# EAGLE design decoder (EAGLE 6.2)
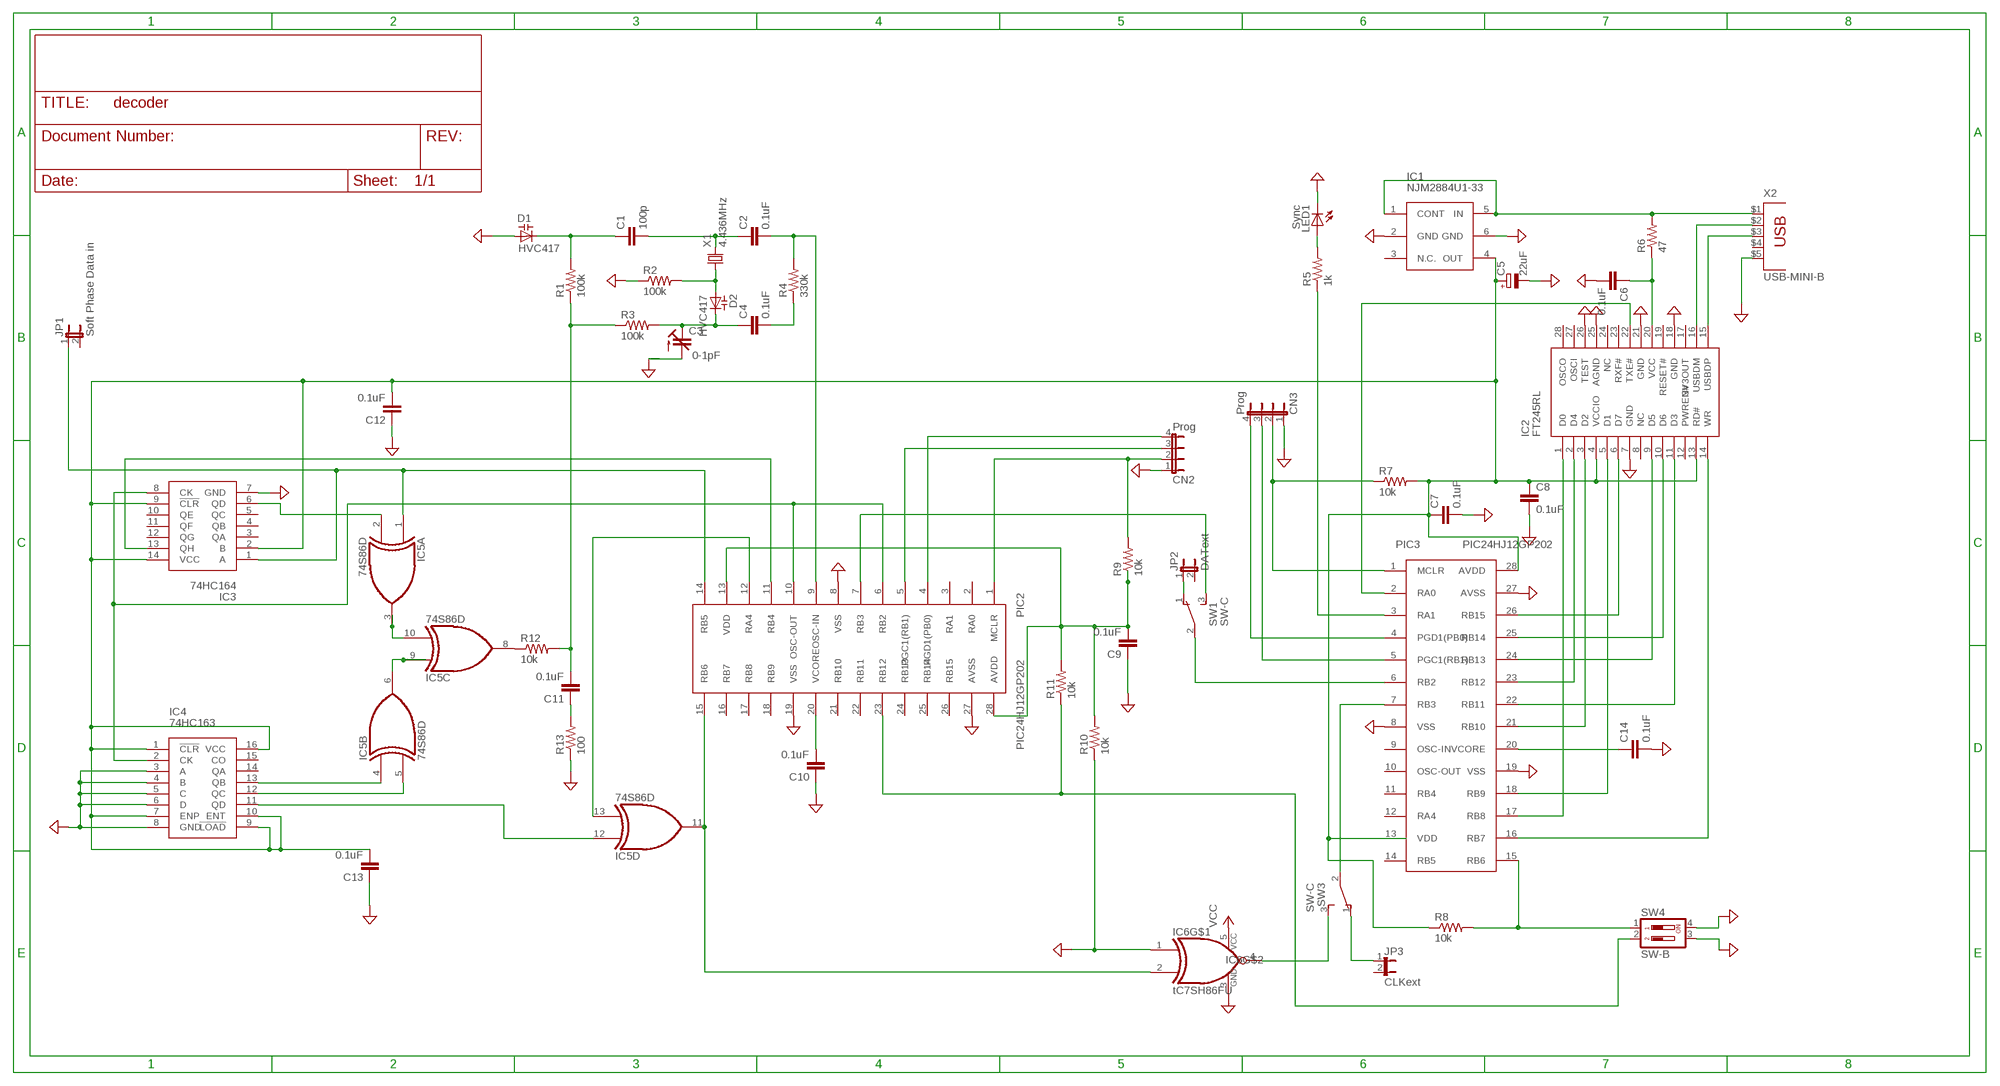
[diagram p0: schematic, sheet 1]

## Parts
C1  100p  C-EU025-025X050  [C025-025X050]
C2  0.1uF  C-EU050-025X075  [C050-025X075]
C3  0-1pF  C-TRIMMTZ03  [CTRIMTZ03]
C4  0.1uF  C-EU050-025X075  [C050-025X075]
C5  22uF  CPOL-EUE3.5-8  [E3,5-8]
C6  0.1uF  C-EU050-025X075  [C050-025X075]
C7  0.1uF  C-EU050-025X075  [C050-025X075]
C8  0.1uF  C-EU050-025X075  [C050-025X075]
C9  0.1uF  C-EU050-025X075  [C050-025X075]
C10  0.1uF  C-EU050-025X075  [C050-025X075]
C11  0.1uF  C-EU050-025X075  [C050-025X075]
C12  0.1uF  C-EU050-025X075  [C050-025X075]
C13  0.1uF  C-EU050-025X075  [C050-025X075]
C14  0.1uF  C-EU050-025X075  [C050-025X075]
CN2  Prog  JP4E  [JP4]
CN3  Prog  JP4E  [JP4]
D1  HVC417  BB112  [SOT54H]
D2  HVC417  BB112  [SOT54H]
IC1  NJM2884U1-33  [NJM2884U1-33]
IC2  FT245RL  [FT245RL]
IC3  74HC164  [74HC164]
IC4  74HC163  [74HC163]
IC5  74S86D  [SO14]
IC6  tC7SH86FU  TC7SH86FU  [TC7SH86FU]
JP1  Soft Phase Data in  JP1E  [JP1]
JP2  DAText  JP1E  [JP1]
JP3  CLKext  JP1E  [JP1]
LED1  Sync  LED5MM  [LED5MM]
PIC2  PIC24HJ12GP202  [PIC24HJ12GP202]
PIC3  PIC24HJ12GP202  [PIC24HJ12GP202]
R1  100k  R-US_0207/7  [0207/7]
R2  100k  R-US_0207/7  [0207/7]
R3  100k  R-US_0207/7  [0207/7]
R4  330k  R-US_0207/7  [0207/7]
R5  1k  R-US_0207/7  [0207/7]
R6  47  R-US_0207/7  [0207/7]
R7  10k  R-US_0207/7  [0207/7]
R8  10k  R-US_0207/7  [0207/7]
R9  10k  R-US_0207/7  [0207/7]
R10  10k  R-US_0207/7  [0207/7]
R11  10k  R-US_0207/7  [0207/7]
R12  10k  R-US_0207/7  [0207/7]
R13  100  R-US_0207/7  [0207/7]
SW1  SW-C  TL36PO  [TL3XPO]
SW3  SW-C  TL36PO  [TL3XPO]
SW4  SW-B  DIP02YL  [DIP02YL]
X1  4.436MHz  CRYSTALHC49S  [HC49/S]
X2  USB-MINI-B  [USB-MINI-B]

## Nets
GND: C3.2(A) C5.- C6.2 C7.2 C8.2 C9.1 C10.1 C12.1 C13.1 C14.2 CN2.1 CN3.1 D1.A IC1.2(GND) IC1.6(GND) IC2.7(GND) IC2.18(GND) IC2.21(GND) IC2.25(AGND) IC2.26(TEST) IC3.7(GND) IC4.3(A) IC4.4(B) IC4.5(C) IC4.6(D) IC4.8(GND) IC6.1(I0) IC6.3(GND) LED1.K(C) PIC2.8(VSS) PIC2.19(VSS) PIC2.27(AVSS) PIC3.8(VSS) PIC3.19(VSS) PIC3.27(AVSS) R2.1 R10.1 R13.1 SW4.3 SW4.4 X2.$5
N$1: IC1.1(CONT) IC1.5(IN) R6.2 X2.$1
N$2: C4.2 R4.1
N$3: C1.2 C2.1 X1.2
N$4: C2.2 PIC2.9(OSC-IN) R4.2
N$5: CN2.2 PIC2.1(MCLR) R9.2
N$6: C3.1(E) C4.1 D2.C R3.2
N$7: C1.1 D1.C R1.2
N$8: IC5.8(C:O) R12.1
N$9: C10.2 PIC2.20(VCORE)
N$10: PIC2.23(RB12) R11.1 SW4.2
N$11: PIC3.15(RB6) R8.2 SW4.1
N$12: C11.1 R13.2
N$13: PIC2.7(RB3) SW1.3(S)
N$14: PIC3.6(RB2) SW1.2(P)
N$15: IC5.11(D:O) IC6.2(I1) PIC2.15(RB6)
N$16: PIC3.3(RA1) R5.1
N$17: PIC3.7(RB3) SW3.2(P)
N$18: C9.2 PIC2.13(VDD) PIC2.28(AVDD) R9.1 R10.2 R11.2
N$19: IC2.22(TXE#) PIC3.2(RA0)
N$20: C11.2 R1.1 R3.1 R12.2
N$21: IC5.6(B:O) IC5.9(C:I0)
N$22: IC5.3(A:O) IC5.10(C:I1)
N$23: IC3.1(A) IC5.1(A:I0) JP1.1 PIC2.14(RB5)
N$24: IC5.13(D:I1) PIC2.12(RA4)
N$25: IC2.14(WR) PIC3.16(RB7)
N$26: D2.A R2.2 X1.1
N$27: IC2.10(D6) PIC3.25(RB14)
N$28: IC2.15(USBDP) X2.$3
N$29: IC2.16(USBDM) X2.$2
N$30: IC2.11(D3) PIC3.22(RB11)
N$31: IC2.9(D5) PIC3.24(RB13)
N$32: IC2.1(D0) PIC3.17(RB8)
N$33: IC2.2(D4) PIC3.23(RB12)
N$34: IC2.3(D2) PIC3.21(RB10)
N$35: IC2.5(D1) PIC3.18(RB9)
N$36: IC2.6(D7) PIC3.26(RB15)
N$37: IC3.6(QD) IC5.2(A:I1)
N$38: IC3.13(QH) PIC2.11(RB4)
N$39: IC4.13(QB) IC5.4(B:I0)
N$40: IC4.12(QC) IC5.5(B:I1)
N$41: IC4.11(QD) IC5.12(D:I0)
N$42: JP3.1 SW3.1(O)
N$43: C5.+ C7.1 C8.1 C12.2 C13.2 IC1.4(OUT) IC2.4(VCCIO) IC2.13(RD#) IC3.2(B) IC3.9(!CLR) IC3.14(VCC) IC4.1(!CLR) IC4.7(ENP) IC4.9(!LOAD) IC4.10(ENT) IC4.16(VCC) PIC3.28(AVDD) R7.2 R8.1
N$44: IC3.8(CK) IC4.2(CK) PIC2.6(RB2) PIC2.10(OSC-OUT)
N$45: C6.1 IC2.20(VCC) R6.1
N$46: CN2.3 PIC2.5(PGC1(RB1))
N$47: CN2.4 PIC2.4(PGD1(PB0))
N$48: CN3.2 PIC3.1(MCLR) R7.1
N$49: CN3.3 PIC3.5(PGC1(RB1))
N$50: CN3.4 PIC3.4(PGD1(PB0))
N$51: LED1.A R5.2
N$52: JP2.1 SW1.1(O)
N$53: IC6.4(O) SW3.3(S)
N$54: C14.1 PIC3.20(VCORE)
VCC: IC6.5(VCC)
Unconnected: IC1.3(N.C.) IC2.8(NC) IC2.12(PWREN#) IC2.17(3V3OUT) IC2.19(RESET#) IC2.23(RXF#) IC2.24(NC) IC2.27(OSCI) IC2.28(OSCO) IC3.3(QA) IC3.4(QB) IC3.5(QC) IC3.10(QE) IC3.11(QF) IC3.12(QG) IC4.14(QA) IC4.15(CO) JP1.2 JP2.2 JP3.2 PIC2.2(RA0) PIC2.3(RA1) PIC2.16(RB7) PIC2.17(RB8) PIC2.18(RB9) PIC2.21(RB10) PIC2.22(RB11) PIC2.24(RB13) PIC2.25(RB14) PIC2.26(RB15) PIC3.9(OSC-IN) PIC3.10(OSC-OUT) PIC3.11(RB4) PIC3.12(RA4) PIC3.14(RB5) X2.$4

## Power pins joined to a net without a drawn wire
GND: IC5.7(P:GND)
VCC: IC5.14(P:VCC)
VDD: PIC3.13(VDD)

## Library data of the parts
C1 = rcl:C-EU: CAPACITOR, European symbol
C2 C4 C6-C14 = resistor:C-EU: CAPACITOR, European symbol
C3 = rcl:C-TRIMM: Trimm capacitor
C5 = resistor:CPOL-EU: POLARIZED CAPACITOR, European symbol
CN2 CN3 = jumper:JP4E: JUMPER
D1 D2 = diode:BB112: Capacity DIODE variable-capacitance diode
IC1 = MyLib:NJM2884U1-33: 18bits Delta-Sigma A/D SOT23 6pin
IC2 = MyLib:FT245RL
IC3 = MyLib:74HC164
IC4 = MyLib:74HC163
IC5 = 74xx-us:74*86: Quad 2-input EXCLUSIV-OR (XOR) gate
IC6 = MyLib:TC7SH86FU: 東芝CMOSデジタル集積回路 シリコン モノリシック
JP1-JP3 = jumper:JP1E: JUMPER
LED1 = led:LED: LED OSRAM: - CHIPLED LG R971, LG N971, LY N971, LG Q971, LY Q971, LO R971, LY R971 LH N974, LH R974 LS Q976, LO Q976, LY Q976 LO Q996 - Hyper CHIPLED LW Q18S LB Q993, LB Q99A, LB R99A - SideLED LS A670, LO A670, LY A670, LG A670, LP A670 LB A673, LV A673, LT A673, LW A673 LH A674 LY A675 LS A676, LA A676, LO A676, LY A676, LW A676 LS A679, LY A679, LG A679 - Hyper Micro SIDELED® LS Y876, LA Y876, LO Y876, LY Y876 LT Y87S - SmartLED LW L88C, LW L88S LB L89C, LB L89S, LG L890 LS L89K, LO L89K, LY L89K LS L896, LA L896, LO L896, LY L896 - TOPLED LS T670, LO T670, LY T670, LG T670, LP T670 LSG T670, LSP T670, LSY T670, LOP T670, LYG T670 LG T671, LOG T671, LSG T671 LB T673, LV T673, LT T673, LW T673 LH T674 LS T676, LA T676, LO T676, LY T676, LB T676, LH T676, LSB T676, LW T676 LB T67C, LV T67C, LT T67C, LS T67K, LO T67K, LY T67K, LW E67C LS E67B, LA E67B, LO E67B, LY E67B, LB E67C, LV E67C, LT E67C LW T67C LS T679, LY T679, LG T679 LS T770, LO T770, LY T770, LG T770, LP T770 LB T773, LV T773, LT T773, LW T773 LH T774 LS E675, LA E675, LY E675, LS T675 LS T776, LA T776, LO T776, LY T776, LB T776 LHGB T686 LT T68C, LB T68C - Hyper Mini TOPLED® LB M676 - Mini TOPLED Santana® LG M470 LS M47K, LO M47K, LY M47K Source: http://www.osram.convergy.de LUXEON: - LUMILED® LXK2-PW12-R00, LXK2-PW12-S00, LXK2-PW14-U00, LXK2-PW14-V00 LXK2-PM12-R00, LXK2-PM12-S00, LXK2-PM14-U00 LXK2-PE12-Q00, LXK2-PE12-R00, LXK2-PE12-S00, LXK2-PE14-T00, LXK2-PE14-U00 LXK2-PB12-K00, LXK2-PB12-L00, LXK2-PB12-M00, LXK2-PB14-N00, LXK2-PB14-P00, LXK2-PB14-Q00 LXK2-PR12-L00, LXK2-PR12-M00, LXK2-PR14-Q00, LXK2-PR14-R00 LXK2-PD12-Q00, LXK2-PD12-R00, LXK2-PD12-S00 LXK2-PH12-R00, LXK2-PH12-S00 LXK2-PL12-P00, LXK2-PL12-Q00, LXK2-PL12-R00 Source: www.luxeon.com KINGBRIGHT: KA-3528ASYC Source: www.kingbright.com
PIC2 PIC3 = MyLib:PIC24HJ12GP202
R1-R13 = rcl:R-US_: RESISTOR, American symbol
SW1 SW3 = switch:TL36PO: TINY SWITCH ON - ON Source: http://www2.produktinfo.conrad.com/datenblaetter/700000-724999/705152-da-01-de-Subminiaturschalter_TL_36YO.pdf
SW4 = switch-dil:DIP02YL: DIL/CODE SWITCH; OC_FARNELL: unknown; OC_NEWARK: unknown
X1 = crystal:CRYSTAL: CRYSTAL; OC_FARNELL: 1667008; OC_NEWARK: unknown
X2 = MyLib:USB-MINI-B

## Net classes
0 default: width 0.406 mm
1 gnd: width 1.27 mm

## Board
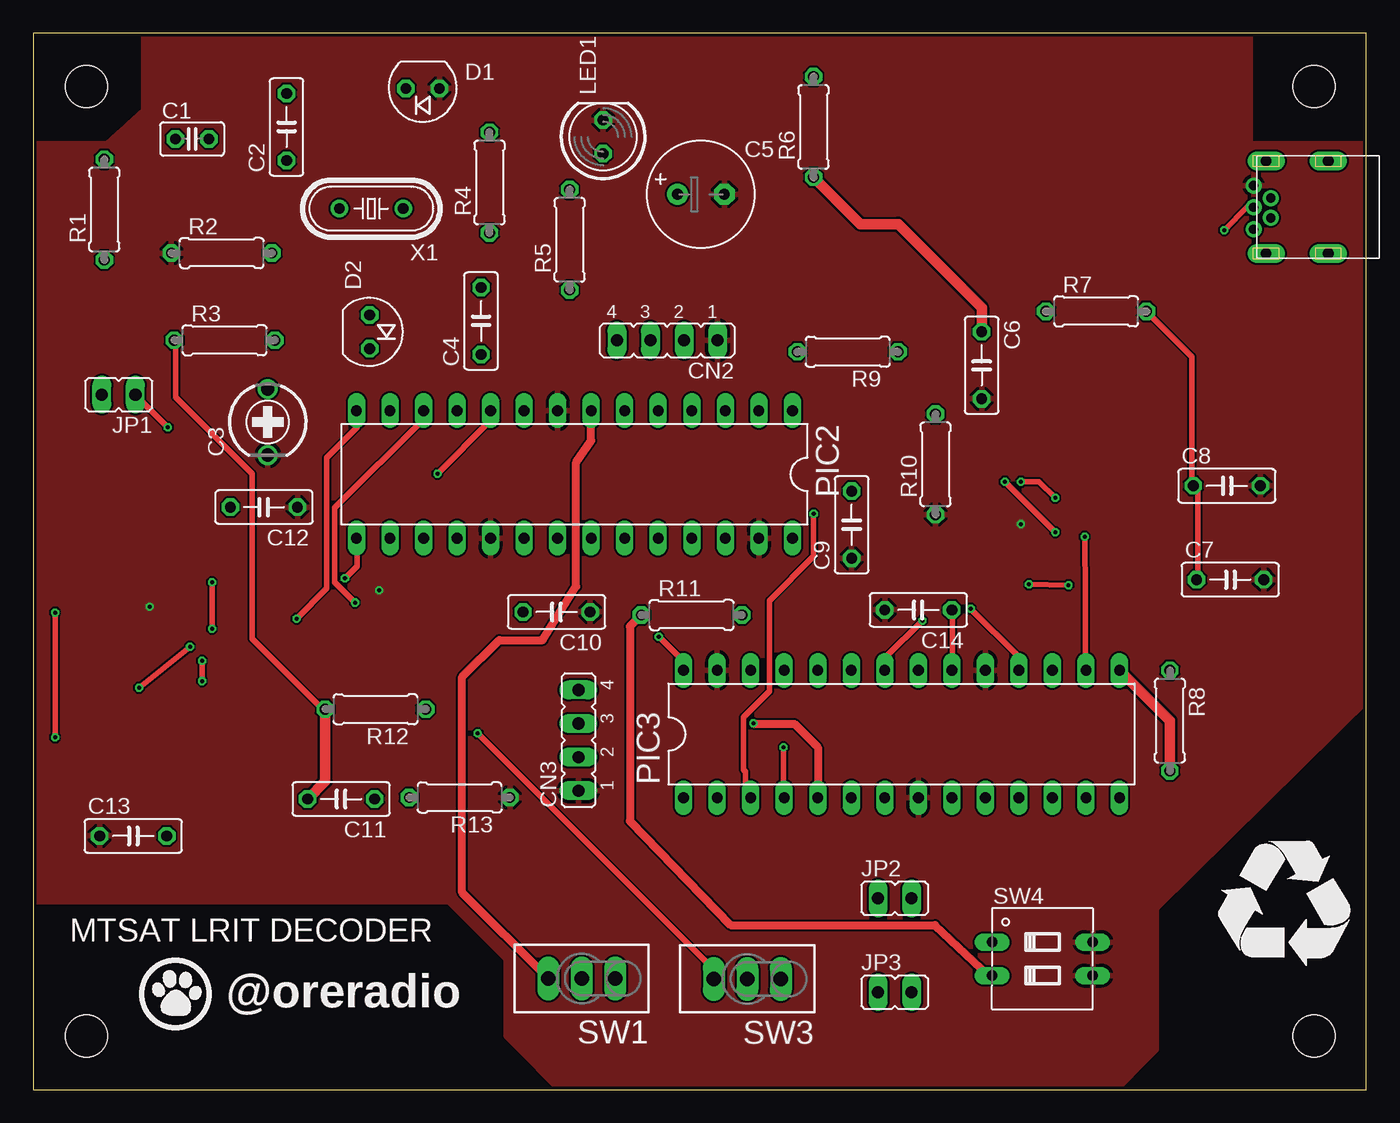
[diagram p1: board, top side]
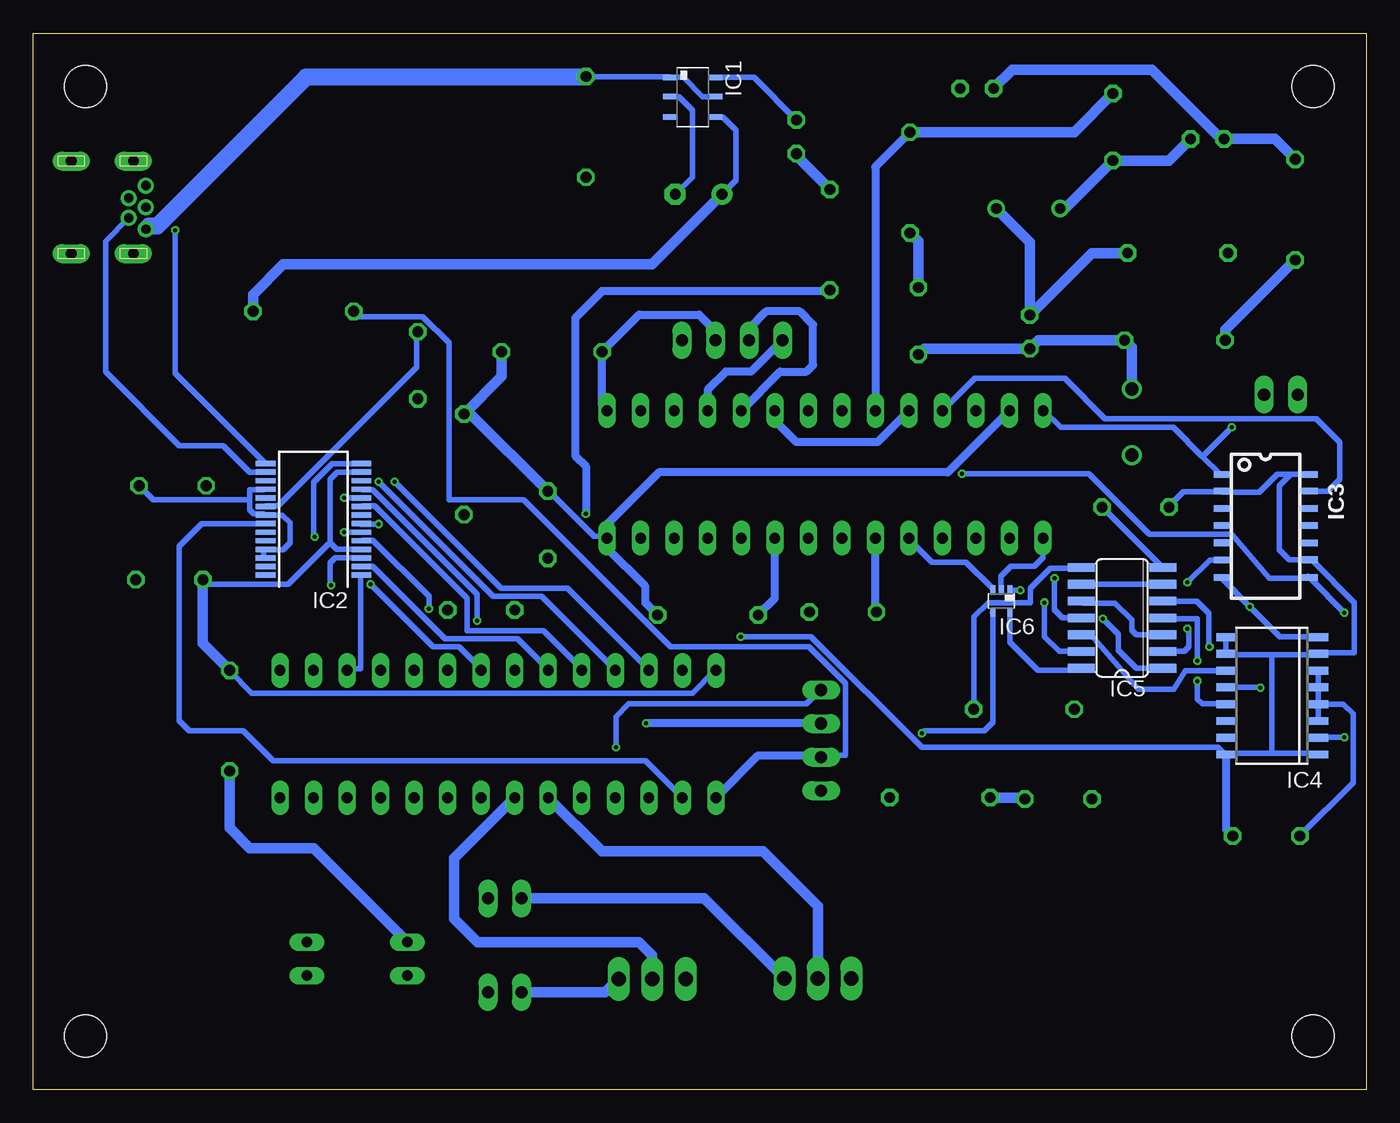
[diagram p2: board, bottom side, seen from below]

Size 101 x 80 mm. Coordinates in mm from the lower left corner, seen from the top.
Outline: 0,0 101,0 101,80 0,80 0,0
Copper layers (1*16): Top 0.035mm / dielectric 1.5mm / Bottom 0.035mm
Design rules: minimum track width 6mil, minimum drill 12mil, track to track 6mil, track to pad 6mil, pad to pad 6mil, via to via 6mil, smd to smd 0mil, copper to edge 10mil, drill to drill 10mil, minimum pad ring 10mil, minimum via ring 6mil, stop-mask expansion 2mil, vias tented up to drill 100mil, thermal gap 10mil
Holes 3.2 mm at 4.06,75.95 4.06,4.06 97.03,4.06 97.03,75.95
tRestrict: area 0.3,72.1 to 7.9,79.8; area 93.2,72.1 to 100.8,79.8; area 93.2,0.3 to 100.8,7.9; area 0.3,0.3 to 7.9,7.9

### Footprints (pad centres in the part's own frame; a part is rotated, then mirrored left to right if it is on the bottom)
C025-025X050 = drill 0.813 octagon: 1 -1.27,0; 2 1.27,0
C050-025X075 = drill 0.813 octagon: 1 -2.54,0; 2 2.54,0
CTRIMTZ03 = drill 1: 1 0,2.5; 2 0,-2.5
E3,5-8 = drill 0.813 pad 1.6: + -1.778,0 | drill 0.813 pad 1.6 octagon: - 1.778,0
JP4 = drill 0.914 long: 1 -3.81,0; 2 -1.27,0; 3 1.27,0; 4 3.81,0
SOT54H = drill 0.813 octagon: A 1.27,0; C -1.27,0
NJM2884U1-33 = smd 0.4 x 1.1: 1 -1.45,-1.75; 2 0,-1.75; 3 1.55,-1.75; 4 1.55,1.65; 5 0,1.65; 6 -1.45,1.65
FT245RL = smd 0.4 x 1.5: 1 -4.225,-3.625; 2 -3.575,-3.625; 3 -2.925,-3.625; 4 -2.275,-3.625; 5 -1.625,-3.625; 6 -0.975,-3.625; 7 -0.325,-3.625; 8 0.325,-3.625; 9 0.975,-3.625; 10 1.625,-3.625; 11 2.275,-3.625; 12 2.925,-3.625; 13 3.575,-3.625; 14 4.225,-3.625; 15 4.225,3.625; 16 3.575,3.625; 17 2.925,3.625; 18 2.275,3.625; 19 1.625,3.625; 20 0.975,3.625; 21 0.325,3.625; 22 -0.325,3.625; 23 -0.975,3.625; 24 -1.625,3.625; 25 -2.275,3.625; 26 -2.925,3.625; 27 -3.575,3.625; 28 -4.225,3.625
74HC164 = smd 0.5 x 1.2: 1 1.518,-3.321; 2 2.788,-3.321; 3 4.096,-3.321; 4 5.404,-3.321; 5 6.699,-3.321; 6 8.007,-3.321; 7 9.329,-3.321; 8 9.316,3.346; 9 7.982,3.346; 10 6.712,3.346; 11 5.404,3.346; 12 4.096,3.346; 13 2.788,3.346; 14 1.518,3.346
74HC163 = smd 0.6 x 1.5: 1 -4.445,-3.49; 2 -3.175,-3.49; 3 -1.905,-3.49; 4 -0.635,-3.49; 5 0.635,-3.49; 6 1.905,-3.49; 7 3.175,-3.49; 8 4.445,-3.49; 9 4.445,3.49; 10 3.175,3.49; 11 1.905,3.49; 12 0.635,3.49; 13 -0.635,3.49; 14 -1.905,3.49; 15 -3.175,3.49; 16 -4.445,3.49
SO14 = smd 0.66 x 2.032: 1 -3.81,-3.073; 2 -2.54,-3.073; 3 -1.27,-3.073; 4 0,-3.073; 5 1.27,-3.073; 6 2.54,-3.073; 7 3.81,-3.073; 8 3.81,3.073; 9 2.54,3.073; 10 1.27,3.073; 11 0,3.073; 12 -1.27,3.073; 13 -2.54,3.073; 14 -3.81,3.073
TC7SH86FU = smd 0.4 x 0.7: 1 -0.65,-0.85; 2 0,-0.85; 3 0.65,-0.85; 4 0.65,0.85; 5 -0.65,0.85
JP1 = drill 0.914 long: 1 0,-1.27; 2 0,1.27
LED5MM = drill 0.813 octagon: A -1.27,0; K 1.27,0
PIC24HJ12GP202 = drill 0.813 long: 1 -16.51,-4.826; 2 -13.97,-4.826; 3 -11.43,-4.826; 4 -8.89,-4.826; 5 -6.35,-4.826; 6 -3.81,-4.826; 7 -1.27,-4.826; 8 1.27,-4.826; 9 3.81,-4.826; 10 6.35,-4.826; 11 8.89,-4.826; 12 11.43,-4.826; 13 13.97,-4.826; 14 16.51,-4.826; 15 16.51,4.826; 16 13.97,4.826; 17 11.43,4.826; 18 8.89,4.826; 19 6.35,4.826; 20 3.81,4.826; 21 1.27,4.826; 22 -1.27,4.826; 23 -3.81,4.826; 24 -6.35,4.826; 25 -8.89,4.826; 26 -11.43,4.826; 27 -13.97,4.826; 28 -16.51,4.826
0207/7 = drill 0.813 octagon: 1 -3.81,0; 2 3.81,0
TL3XPO = drill 1.1 pad 1.422 long: 1 -2.54,0; 2 0,0; 3 2.54,0
DIP02YL = drill 0.813 long: 1 -1.27,-3.81; 2 1.27,-3.81; 3 1.27,3.81; 4 -1.27,3.81
HC49/S = drill 0.813: 1 -2.413,0; 2 2.413,0
USB-MINI-B = drill 0.7 pad 0.813: $1 3.05,1.65; $2 1.75,0.8; $3 3.05,0; $4 1.75,-0.7; $5 3.05,-1.65 | drill 0.8 pad 1.422 long: P$1 2.1,3.5; P$2 2.1,-3.5; P$3 -2.6,-3.5; P$4 -2.6,3.5

### Placement (x,y rotation side)
C1  12.05,71.98 0 top
C2  19.21,72.88 90 top
C3  17.78,50.55 0 top
C4  33.94,58.2 90 top
C5  50.59,67.79 0 top
C6  71.85,54.84 270 top
C7  90.68,38.61 0 top
C8  90.42,45.72 0 top
C9  62.01,42.77 90 top
C10  39.66,36.17 180 top
C11  23.34,22 180 top
C12  17.49,44.1 180 top
C13  7.59,19.21 0 top
C14  67.06,36.32 180 top
CN2  48.04,56.74 180 top
CN3  41.3,26.45 90 top
D1  29.51,75.81 0 top
D2  25.5,57.37 90 top
IC1  50.97,75.19 270 bottom
IC2  79.76,43.18 90 bottom
IC3  7.65,48.1 270 bottom
IC4  7.14,29.82 90 bottom
IC5  18.51,35.72 90 bottom
IC6  27.65,36.99 180 bottom
JP1  6.49,52.63 90 top
JP2  65.28,14.48 270 top
JP3  65.28,7.37 270 top
LED1  43.18,72.14 90 top
PIC2  41.01,46.58 180 top
PIC3  65.79,26.92 0 top
R1  5.4,66.63 90 top
R2  14.29,63.34 0 top
R3  14.51,56.74 0 top
R4  34.58,68.68 90 top
R5  40.64,64.34 90 top
R6  59.12,72.89 90 top
R7  80.52,58.93 0 top
R8  86.11,27.94 270 top
R9  61.7,55.87 180 top
R10  68.36,47.34 90 top
R11  49.88,35.94 0 top
R12  25.94,28.8 180 top
R13  32.31,22.12 180 top
SW1  41.56,8.41 180 top
SW3  54.1,8.38 180 top
SW4  76.45,9.91 270 top
U$36  [LOGO]  8.13,4.57 0 top
U$38  [RECYCLING_10.00]  89.66,9.14 0 top
X1  25.62,66.7 180 top
X2  95.5,66.8 180 top

### Tracks (layer width: path | path; a pad name or v marks a point on that pad's centre or on a via)
GND  (via drill 0.3)
  Bottom 0.406: IC3.7 10.97,38.71 v8.84,36.58 6.55,34.29 3.66,34.29 IC4.8 | IC2.26 83.52,40.39 83.52,40.84 IC2.25 83.37,40.89 82.04,40.89 81.53,41.4 81.53,42.93 82.11,43.51 IC2.21 | 83.52,43.59 IC2.21 | 84.58,44.65 84.58,45.41 83.52,45.41 IC2.18 | 84.58,44.65 84.58,43.89 84.28,43.59 83.67,43.59 IC2.21 | IC4.3 3.66,28.04 3.66,29.11 IC4.4 | IC4.4 3.66,29.26 3.66,30.33 IC4.5 3.66,30.63 3.66,31.7 IC4.6 | 76.2,42.82 IC2.7 76.05,42.82 v74.83,42.82 | v26.21,37.8 26.98,37.8 IC6.1 | IC6.3 28.35,37.95 30.33,39.93 32.92,39.93 34.59,41.6 PIC2.19 | IC5.7 15.54,39.62 19.96,44.04 C12.1 | 84.58,44.65 91.9,44.65 C8.2 | LED1.K 46.41,76.64 IC1.6 | C5.- 51.05,69.1 51.05,74.17 52.07,75.19 IC1.2 | C13.1 1.02,23.24 1.02,28.45 1.75,29.18 IC4.4
  pour Top: 8.38,81.03 8.38,74.17 5.59,71.63 -1.52,71.63 -1.52,15.24 -0.51,14.22 31.5,14.22 35.81,9.91 35.81,4.06 40.64,-0.76 81.28,-0.76 85.09,3.05 85.09,13.72 104.14,32.51 103.63,69.09 101.6,71.63 92.2,71.63 92.2,80.77
N$1
  Bottom 0.406: IC1.5 50.29,75.18 51.74,76.64 IC1.1 52.78,76.7 R6.2
  Bottom 1.27: X2.$1 92.35,65.23 92.2,65.38 91.59,65.38 80.31,76.66 59.13,76.66 R6.2
N$2
  Bottom 0.813: R4.1 33.94,64.23 C4.2
N$3
  Bottom 0.813: C1.2 14.96,70.34 C2.1 22.85,66.7 X1.2
N$4
  Bottom 0.61: R4.2 37.2,69.87 PIC2.9
  Bottom 0.813: C2.2 22.14,72.49 R4.2
N$5
  Bottom 0.61: PIC2.1 57.89,51.78 R9.2 55.09,58.67 50.55,58.67 49.31,57.44 CN2.2
N$6
  Bottom 0.813: C4.1 33.49,56.1 D2.C 24.86,56.74 R3.2 17.78,56.2 C3.1
N$7
  Bottom 0.813: D1.C 26.83,77.22 16.26,77.22 11.02,71.98 C1.1 6.94,71.98 R1.2
N$8
  Bottom 0.406: IC5.8 21.64,39.47 23.93,39.47 25.45,37.95 25.45,36.88 28.65,36.88 29.72,35.81 29.72,28.8 R12.1
N$9
  Bottom 0.61: C10.2 37.2,36.25 PIC2.20
N$10
  Top 0.61: R11.1 45.21,35.08 45.21,20.32 52.83,12.45 68.33,12.45 72.39,8.64 SW4.2
  Bottom 0.61: R11.1 44.82,37.2 PIC2.23
N$11
  Top 0.813: PIC3.15 86.11,27.94 R8.2
  Bottom 0.813: SW4.1 79.76,18.29 84.58,18.29 86.11,19.81 R8.2
N$12
  Bottom 0.813: C11.1 25.99,22.12 R13.2
N$13
  Top 0.61: SW1.3 32.51,14.92 32.51,31.24 35.31,34.04 38.61,34.04 41.15,38.1 41.15,47.5 42.28,49.13 PIC2.7
N$14
  Bottom 0.813: PIC3.6 57.91,18.03 45.72,18.03 41.56,13.87 SW1.2
N$15  (via drill 0.3)
  Top 0.406: v23.62,38.71 24.54,39.62 24.54,41.6 PIC2.15
  Bottom 0.406: IC6.2 27.69,37.87 27.69,38.86 26.92,39.62 25.15,39.62 24.5,40.27 PIC2.15 | 21.64,35.81 IC5.11 23.02,35.72 23.62,36.32 v23.62,38.71
N$16  (via drill 0.3)
  Top 0.406: v59.13,43.59 59.13,40.39 55.78,37.03 55.78,30.18 53.8,28.19 53.8,24.23 53.95,24.08 53.95,22.4 54.25,22.1 PIC3.3
  Bottom 0.61: R5.1 40.72,60.45 57.91,60.45 59.94,58.42 59.94,48.01 59.13,47.19 v59.13,43.59
N$17
  Bottom 0.813: PIC3.7 69.09,17.53 69.09,12.95 67.31,11.18 55.12,11.18 54.1,10.16 SW3.2
N$18
  Bottom 0.406: C9.2 61.87,45.26 58.52,41.91 57.61,41.91 PIC2.28
  Bottom 0.61: PIC2.13 31.71,46.74 53.59,46.74 57.52,42.81 PIC2.28 57.52,41.01 54.61,38.1 54.61,36.86 R11.2
  Bottom 0.813: C9.2 67.85,51.15 R10.2 65.51,54 R9.1
N$19
  Bottom 0.406: PIC3.2 54.61,24.89 82.8,24.89 85.09,27.18 89.15,27.18 89.92,27.94 89.92,41.15 88.21,42.85 IC2.22
N$20
  Top 0.406: R12.2 21.95,28.8 16.61,34.14 16.61,46.63 10.82,52.43 10.82,56.69 R3.1
  Top 0.813: C11.2 22.13,23.33 R12.2
  Bottom 0.813: R1.1 10.7,57.52 R3.1
N$21
  Bottom 0.406: IC5.6 15.54,38.25 21.49,38.25 IC5.9
N$22
  Bottom 0.406: IC5.10 21.43,36.83 19.05,36.83 17.78,35.56 17.78,34.8 17.43,34.45 IC5.3
N$23  (via drill 0.3)
  Top 0.406: v19.96,35.66 22.25,37.95 22.25,47.85 24.54,50.14 24.54,51.36 PIC2.14 | v10.21,50.14 7.77,52.58 JP1.1
  Bottom 0.406: 15.54,32 IC5.1 17.43,31.91 18.8,33.27 18.8,34.49 v19.96,35.66 | 12.42,47.93 14.63,50.14 23.16,50.14 24.38,51.36 PIC2.14 | 12.42,47.93 11.12,46.63 IC3.1 | 12.42,47.93 v10.21,50.14
N$24  (via drill 0.3)
  Top 0.406: v24.38,36.88 22.86,38.41 22.86,44.04 29.57,50.75 29.57,51.36 PIC2.12
  Bottom 0.406: 21.64,33.22 IC5.13 23.27,33.18 24.38,34.29 v24.38,36.88
N$25  (via drill 0.3)
  Top 0.406: v79.65,41.86 79.7,37.34 79.7,31.85 PIC3.16
  Bottom 0.406: 76.2,47.4 IC2.14 78.33,47.41 79.76,45.97 79.76,41.96 v79.65,41.86
N$26
  Bottom 0.813: R2.2 20.8,63.34 D2.A 25.5,64.17 X1.1
N$27  (via drill 0.3)
  Top 0.406: v77.42,44.81 76.2,46.02 v74.83,46.02
  Bottom 0.406: v77.42,44.81 76.2,44.81 IC2.10 | v74.83,46.02 66.14,37.34 62.48,37.34 PIC3.25
N$28  (via drill 0.3)
  Top 0.406: v90.22,65.08 91.95,66.8 X2.$3
  Bottom 0.406: v90.22,65.08 90.22,54.25 83.52,47.55 IC2.15
N$29
  Bottom 0.406: X2.$2 95.5,64.25 95.5,54.36 89.92,48.77 86.61,48.77 84.6,46.76 IC2.16
N$30  (via drill 0.3)
  Top 0.406: v67.36,35.51 64.62,32.77 64.62,31.85 PIC3.22
  Bottom 0.406: v67.36,35.51 67.36,37.49 75.29,45.41 76.05,45.41 IC2.11
N$31
  Bottom 0.406: IC2.9 76.05,44.2 75.13,44.2 68.12,37.19 68.12,34.75 62.33,34.75 59.44,31.85 PIC3.24
N$32
  Bottom 0.406: IC2.1 76.2,38.86 76.2,31.85 77.11,31.85 PIC3.17
N$33
  Bottom 0.406: IC2.2 76.05,39.62 75.29,39.62 69.8,34.14 64.31,34.14 62.03,31.85 PIC3.23
N$34  (via drill 0.3)
  Top 0.406: v75.44,38.25 v78.44,38.2
  Bottom 0.406: v75.44,38.25 70.71,33.53 68.73,33.53 67.06,31.85 PIC3.21 | 76.2,40.23 IC2.3 78.11,40.26 78.49,39.88 78.49,38.25 v78.44,38.2
N$35  (via drill 0.3)
  Top 0.406: v71.02,36.42 74.68,32.77 PIC3.18
  Bottom 0.406: v71.02,36.42 71.02,37.34 75.29,41.6 76.05,41.6 IC2.5
N$36  (via drill 0.3)
  Top 0.406: v73.61,46.02 v77.42,42.22
  Bottom 0.406: v77.42,42.22 76.2,42.22 IC2.6 | v73.61,46.02 65.53,37.95 60.5,37.95 54.41,31.85 PIC3.26
N$37  (via drill 0.3)
  Top 0.406: v13.56,34.9 v13.56,38.41
  Bottom 0.406: 11.12,40.08 IC3.6 11.87,40.1 v13.56,38.41 | 15.39,33.22 IC5.2 13.81,33.18 13.46,33.53 13.46,34.8 v13.56,34.9
N$38
  Bottom 0.406: PIC2.11 29.67,53.85 22.86,53.85 19.81,50.8 3.81,50.8 2.03,49.02 2.03,46.23 2.94,45.32 IC3.13
N$39  (via drill 0.3)
  Top 0.406: v12.8,32.46 v12.8,30.94
  Bottom 0.406: v12.8,32.46 12.8,35.66 15.39,35.66 IC5.4 | IC4.13 10.67,29.26 10.72,29.21 12.45,29.21 12.8,29.57 v12.8,30.94
N$40  (via drill 0.3)
  Top 0.406: v11.89,33.53 v8.03,30.43
  Bottom 0.406: 10.52,30.48 IC4.12 8.05,30.45 v8.03,30.43 | 15.39,36.88 IC5.5 12.86,36.99 11.94,36.07 11.94,33.58 v11.89,33.53
N$41
  Bottom 0.406: IC4.11 10.67,31.7 13.72,31.7 14.58,30.33 17.27,30.33 20.88,34.44 21.49,34.44 IC5.12
N$42
  Bottom 0.813: SW3.1 57.66,7.37 JP3.1
N$43  (via drill 0.3)
  Top 0.406: C7.1 88.24,38.71 88.24,45.41 87.94,45.72 C8.1 87.78,45.87 87.78,55.47 R7.2 | v47.4,34.29 49.23,32.46 49.23,31.85 PIC3.28
  Bottom 0.406: C12.2 14.94,44.2 13.87,45.26 11.12,45.26 IC3.2 10.87,45.21 8.13,45.21 6.75,46.59 5.74,46.59 | 7.16,32.92 10.52,32.92 IC4.10 10.67,33.07 10.67,34.14 IC4.9 | 7.16,32.92 3.66,32.92 IC4.7 3.5,33.07 0.91,33.07 0.91,36.88 4.12,40.08 IC3.9 4.32,40.13 5.84,40.13 6.6,40.89 6.6,45.72 5.74,46.59 | 7.16,25.45 10.52,25.45 IC4.16 10.82,25.45 11.28,25.91 33.68,25.91 42.06,34.29 v47.4,34.29 | 7.16,25.45 3.66,25.45 IC4.1 | 7.16,25.45 7.16,32.92 | PIC3.28 49.38,31.7 51.05,30.02 84.43,30.02 86.11,31.7 R8.1 | C5.+ 47.75,68.84 47.75,72.64 48.74,73.64 IC1.4 | 5.74,46.59 IC3.14 | IC2.13 76.15,46.74 77.98,46.74 78.49,46.23 78.49,41.4 | 78.49,41.4 77.99,40.91 IC2.4 | 78.49,41.4 78.64,41.3 81.69,38.25 87.78,38.25 C7.1
  Bottom 0.61: C13.2 10.63,19.71 IC4.16
  Bottom 0.813: C5.+ 54.11,62.48 82.04,62.48 84.33,60.2 R7.2 | R8.1 88.14,33.78 C7.1
N$44  (via drill 0.3)
  Top 0.406: v1.68,26.67 v1.68,36.12 | v30.63,46.63 34.59,50.6 34.59,51.36 PIC2.10
  Bottom 0.406: v1.68,36.12 4.27,38.71 IC3.8 4.42,38.86 4.78,38.71 7.37,38.71 10.21,42.06 16.46,42.06 21.03,46.63 v30.63,46.63 | v1.68,26.67 3.5,26.67 IC4.2
  Bottom 0.61: PIC2.10 37.04,49.02 43.18,49.02 44.82,50.66 PIC2.6
N$45
  Top 0.813: R6.1 62.66,65.53 65.53,65.53 71.85,59.21 C6.1
  Bottom 0.406: IC2.20 83.36,44.2 82.45,44.2 71.93,54.71 71.93,57.3 C6.1
N$46
  Bottom 0.61: PIC2.5 44.41,54.36 42.42,54.36 41.91,54.86 41.91,57.91 42.93,58.93 45.47,58.93 46.77,57.63 CN2.3
N$47
  Bottom 0.61: CN2.4 46.61,54.36 48.51,54.36 49.9,52.97 PIC2.4
N$48
  Bottom 0.406: R7.1 76.66,58.83 76.35,58.52 71.48,58.52 69.49,56.54 69.49,44.65 63.86,44.65 52.73,33.53 42.22,33.53 39.47,30.79 39.47,25.3 40.64,25.3 41.15,25.3 CN3.2
  Bottom 0.61: PIC3.1 46.08,25.3 40.64,25.3
N$49  (via drill 0.3)
  Top 0.61: v54.56,27.74 54.61,27.69 57.66,27.69 59.44,25.91 PIC3.5
  Bottom 0.406: CN3.3 41.3,27.74 41.45,27.74
  Bottom 0.61: 41.45,27.74 v54.56,27.74
N$50  (via drill 0.3)
  Top 0.406: PIC3.4 56.84,22.15 v56.84,25.91
  Bottom 0.406: v56.84,25.91 56.84,28.25 55.88,29.21 42.42,29.21 41.45,30.18 41.45,30.33 CN3.4
N$51
  Bottom 0.813: R5.2 43.18,70.69 LED1.A
N$52
  Bottom 0.813: SW1.1 50.16,14.48 JP2.1
N$53  (via drill 0.3)
  Top 0.406: v33.68,26.98 51.51,9.14 51.51,8.38 SW3.3
  Bottom 0.406: 28.35,36.12 IC6.4 28.3,27.83 28.96,27.18 33.48,27.18 v33.68,26.98
N$54
  Top 0.406: PIC3.20 69.65,31.85 69.65,36.27 C14.1
VCC
  Bottom 0.406: IC5.14 21.74,31.75 24.89,31.75 27,33.86 IC6.5

### Text on the board
tNames: Order Number: 53979 | MTSAT LRIT DECODER